# Altium schematic sheet MMF2.SchDoc
size A4; SheetNumber: 6; SheetTotal: 8; ENG_APP_DATE: --/--/--; DSN_APP_DATE: --/--/--; CHK_APP_DATE: --/--/--
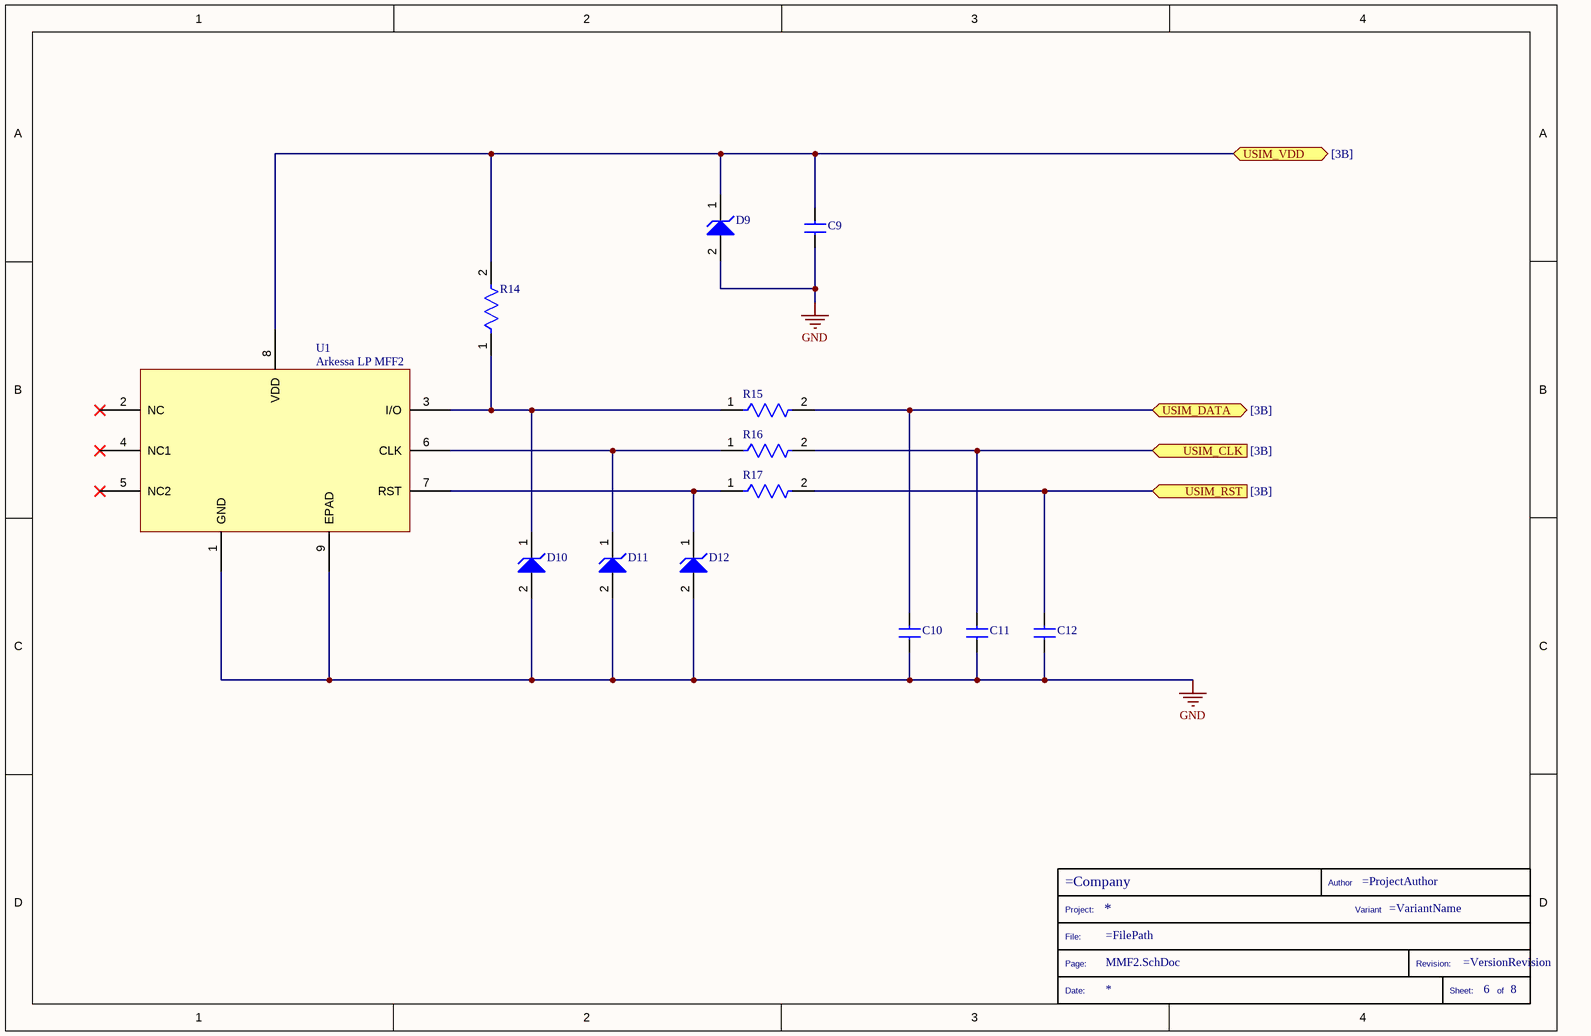
[diagram p0: MMF2.SchDoc]

## Parts
*?  TitleBlock  (value not drawn)  (graphical)
C9  CL05B104KB54PNC  [CAPC1005X06N]  (value not drawn)
C10  GJM1555C1H330GB01D  [CAPC1005X06N]  (value not drawn)
C11  GJM1555C1H330GB01D  [CAPC1005X06N]  (value not drawn)
C12  GJM1555C1H330GB01D  [CAPC1005X06N]  (value not drawn)
D9  ESD9L5.0ST5G  [ONSC-SOD-923-2-514AA-01_V]  (value not drawn)
D10  ESD9L5.0ST5G  [ONSC-SOD-923-2-514AA-01_V]  (value not drawn)
D11  ESD9L5.0ST5G  [ONSC-SOD-923-2-514AA-01_V]  (value not drawn)
D12  ESD9L5.0ST5G  [ONSC-SOD-923-2-514AA-01_V]  (value not drawn)
R14  0402WGF1502TCE  [FP-CRCW0402-e3-MFG]  (value not drawn)
R15  0402WGF220JTCE  [FP-CRCW0402-e3-MFG]  (value not drawn)
R16  0402WGF220JTCE  [FP-CRCW0402-e3-MFG]  (value not drawn)
R17  0402WGF220JTCE  [FP-CRCW0402-e3-MFG]  (value not drawn)
U1  Arkessa LP MFF2  [SON127P600X500X100-9N-D]

## Ports
USIM_CLK (in, see [3B]), USIM_DATA (bidir, see [3B]), USIM_RST (in, see [3B]), USIM_VDD (bidir, see [3B])

## Nets
GND: C9.1 C10.1 C11.1 C12.1 D9.2(A) D10.2(A) D11.2(A) D12.2(A) U1.1(GND) U1.9(EPAD)
USIM_CLK: C11.2 R16.2 ; port USIM_CLK
USIM_DATA: C10.2 R15.2 ; port USIM_DATA
USIM_RST: C12.2 R17.2 ; port USIM_RST
USIM_VDD: C9.2 D9.1(K) R14.2 U1.8(VDD) ; port USIM_VDD
NetD10_1: D10.1(K) R14.1 R15.1 U1.3(I/O)
NetD11_1: D11.1(K) R16.1 U1.6(CLK)
NetD12_1: D12.1(K) R17.1 U1.7(RST)

Not connected (* = marked no-connect by the designer): U1 2(NC)* 4(NC1)* 5(NC2)*

## Notes on the sheet
- DWG. NO.
- REV.
- SHT.
- THIS DOCUMENT AND THE DATA DISCLOSED HEREIN OR HEREWITH IS THE PROPERTY OF ALTIUM LIMITED AND MAY BE FREELY DISTRIBUTED IN WHOLE. NO RIGHTS ARE RESERVED OR EXPRESS OR IMPLIED WARANTEE GIVEN.
- REVISION
- DESCRIPTION
- DATE
- APPROVED
- ENG:
- APPROVALS
- PROJECT
- DSN:
- CHK:
- REFERENCE DOCUMENTS
- PROJECT REVISION:
- TITLE
- DOCUMENT REVISION:
- DESIGN ITEM:
- BOM:
- FAB DWG:
- PCB DWG:
- ASSY DWG:
- SCALE:
- SIZE
- B
- CAGE CODE
- FILE NAME
- DWG NO.
- SHEET
- OF
- REV
- (in symbol TitleBlock) Author; Project:; Variant; File:; Page:; Revision:; Date:; Sheet:; of

## Library data of the parts
C9 = LPN0009: 100nF 50V X7R ±10% 0402 MLCC; Manufacturer 1: TDK; Manufacturer Part Number 1: C1005C0G1H060C; Supplier 1: Digi-Key; Supplier Part Number 1: 1276-CL05B104KB54PNCCT-ND; Lumen Part Number: LPN0009
C10-C12 = LPN00014: 33pF 50V C0G ±2% 0402 MLCC; Manufacturer 1: TDK; Manufacturer Part Number 1: C1005C0G1H060C; Supplier 1: Farnell; Supplier Part Number 1: 3784396; Lumen Part Number: LPN00014
D9-D12 = LPN00012: Transient Voltage Suppressor, ESD Protection Diode with Ultra-Low Capacitance, 2-Pin SOD-923, Pb-Free, Tape and Reel; Manufacturer 1: ON Semiconductor; Manufacturer Part Number 1: ESD9L5.0ST5G; Supplier 1: Digi-Key; Supplier Part Number 1: ESD9L5.0ST5GOSCT-ND; Lumen Part Number: LPN00012
R14 = LPN0002: Res Thick Film 0402 15K Ohm 1% 0.063W; Manufacturer 1: Vishay Dale; Manufacturer Part Number 1: 0402WGF1502TCE; Supplier 1: Farnell; Supplier Part Number 1: 1127145; Lumen Part Number: LPN0002
R15-R17 = LPN0004: Res Thick Film 0402 22R Ohm 1% 0.063W; Manufacturer 1: Vishay Dale; Manufacturer Part Number 1: 0402WGF220JTCE; Supplier 1: Mouser; Supplier Part Number 1: 303-0402WGF220JTCE; Lumen Part Number: LPN0004
U1 = LPN0005: ESIM; Manufacturer Part Number 1: LP MFF2; Lumen Part Number: LPN0005; Manufacturer 1: Arkessa